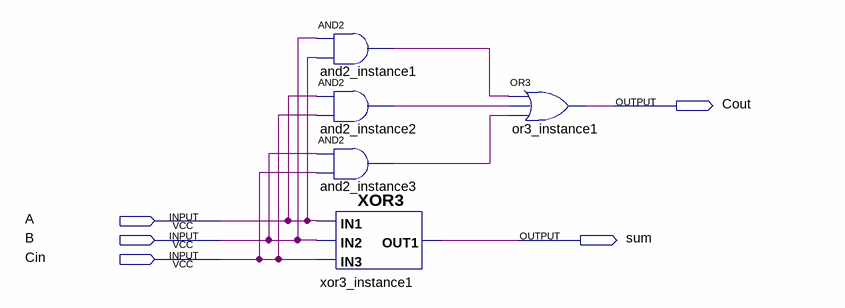
[diagram p0: schematic sheet]
// Quartus schematic 10prelab.bdf as structural Verilog: 5 symbols, 5 pins
module \10prelab  (
  input  A,
  input  B,
  input  Cin,
  output Cout,
  output sum
);

  wire and2_instance1_out, and2_instance2_out, and2_instance3_out;

  and and2_instance1 (and2_instance1_out, B, A);
  and and2_instance2 (and2_instance2_out, A, Cin);
  and and2_instance3 (and2_instance3_out, B, Cin);
  XOR3 xor3_instance1 (.IN3(Cin), .IN1(A), .IN2(B), .OUT1(sum));
  or or3_instance1 (Cout, and2_instance1_out, and2_instance2_out, and2_instance3_out);
endmodule
